# Altium schematic sheet 开关控制器SCH.SchDoc: 恒流恒压开关电源部分
size 381 x 203 mm; Author: Staok; DrawnBy: 许皓阳; Revision: 3.14
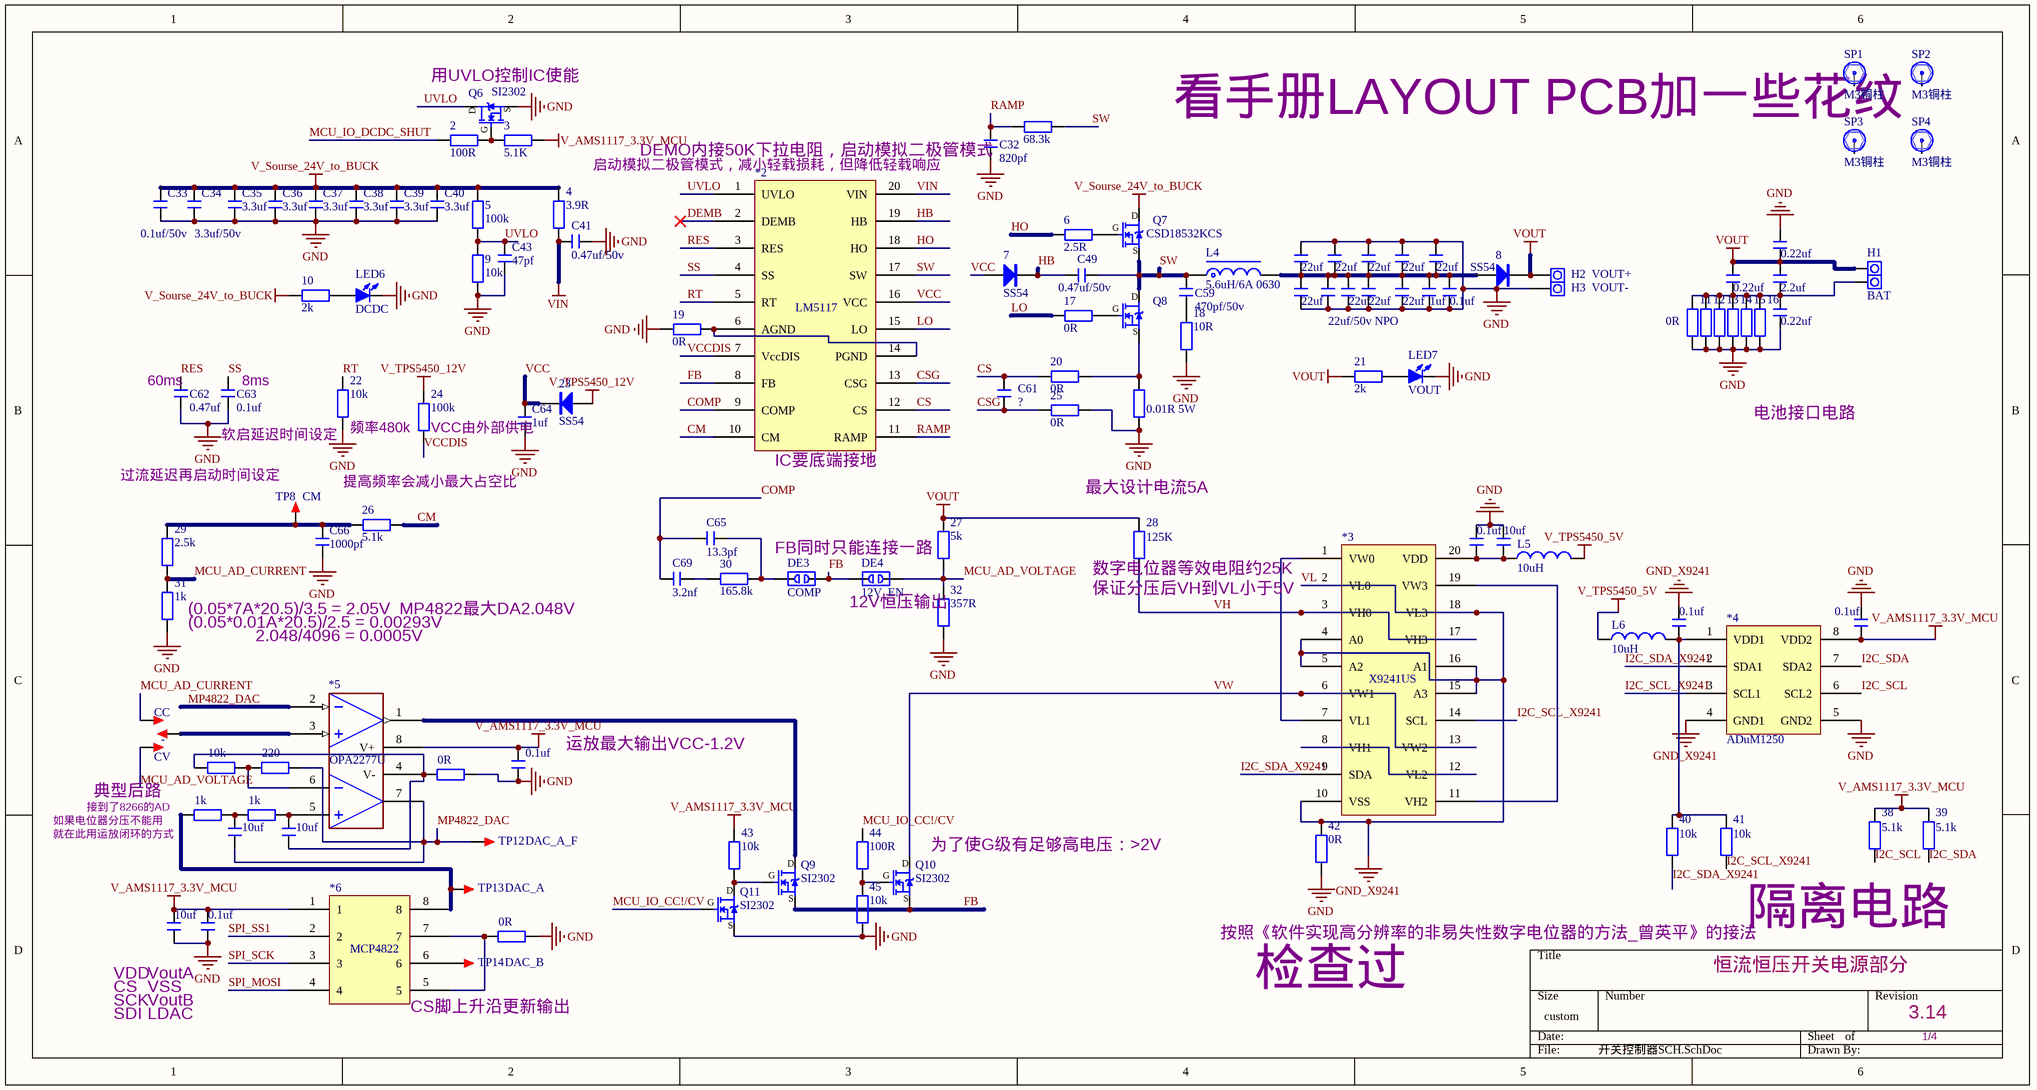
[diagram p0: 开关控制器SCH.SchDoc]

## Parts
1  68.3k  [R 0805_M]
2  100R  [R 0805_M]
3  5.1K  [R 0805_M]
4  3.9R  [R 0805_M]
5  100k  [R 0805_M]
6  2.5R  [R 0805_M]
7  SS54  [SMA]
8  SS54  [SMA]
9  10k  [R 0805_M]
10  2k  [R 0805_M]
11  0R  [R 0805_M]  (value not drawn)
12  0R  [R 0805_M]  (value not drawn)
13  0R  [R 0805_M]  (value not drawn)
14  0R  [R 0805_M]
15  0R  [R 0805_M]  (value not drawn)
16  0R  [R 0805_M]  (value not drawn)
17  0R  [R 0805_M]
18  10R  [R 0805_M]
19  0R  [R 0805_M]
20  0R  [R 0805_M]
21  2k  [R 0805_M]
22  10k  [R 0805_M]
23  SS54  [SMA]
24  100k  [R 0805_M]
25  0R  [R 0805_M]
26  5.1k  [R 0805_M]
27  5k  [R 0805_M]
28  125K  [R 0805_M]
29  2.5k  [R 0805_M]
30  165.8k  [R 0805_M]
31  1k  [R 0805_M]
32  357R  [R 0805_M]
33  10k  [R 0805_M]
34  220  [R 0805_M]
35  0R  [R 0805_M]
36  1k  [R 0805_M]
37  1k  [R 0805_M]
38  5.1k  [R 0805_M]
39  5.1k  [R 0805_M]
40  10k  [R 0805_M]
41  10k  [R 0805_M]
42  0R  [R 0805_M]
43  10k  [R 0805_M]
44  100R  [R 0805_M]
45  10k  [R 0805_M]
46  0R  [R 0805_M]
*2  LM5117  [SSOP20_M]
*3  X9241US  [SOP20_M]
*4  ADuM1250  [SOP8_N]
*5  OPA2277U  [SOP8_M]
*6  MCP4822  [SOP8_M]
C32  820pf  [C 0805_M]
C33  0.1uf/50v  [C 0805_M]
C34  3.3uf/50v  [C 0805_M]
C35  3.3uf  [C 0805_M]
C36  3.3uf  [C 0805_M]
C37  3.3uf  [C 0805_M]
C38  3.3uf  [C 0805_M]
C39  3.3uf  [C 0805_M]
C40  3.3uf  [C 0805_M]
C41  0.47uf/50v  [C 0805_M]
C42  0.22uf  [C 0805_M]
C43  47pf  [C 0805_M]
C44  22uf  [C 0805_M]
C45  22uf  [C 0805_M]
C46  22uf  [C 0805_M]
C47  22uf  [C 0805_M]
C48  22uf  [C 0805_M]
C49  0.47uf/50v  [C 0805_M]
C50  0.22uf  [C 0805_M]
C51  2.2uf  [C 0805_M]
C52  22uf  [C 0805_M]
C53  22uf/50v NPO  [C 0805_M]
C54  22uf  [C 0805_M]
C55  22uf  [C 0805_M]
C56  22uf  [C 0805_M]
C57  1uf  [C 0805_M]
C58  0.1uf  [C 0805_M]
C59  470pf/50v  [C 0805_M]
C60  0.22uf  [C 0805_M]
C61  ?  [C 0805_M]
C62  0.47uf  [C 0805_M]
C63  0.1uf  [C 0805_M]
C64  1uf  [C 0805_M]
C65  13.3pf  [C 0805_M]
C66  1000pf  [C 0805_M]
C67  0.1uf  [C 0805_M]
C68  10uf  [C 0805_M]
C69  3.2nf  [C 0805_M]
C70  0.1uf  [C 0805_M]
C71  0.1uf  [C 0805_M]
C72  0.1uf  [C 0805_M]
C73  10uf  [C 0805_M]
C74  10uf  [C 0805_M]
C75  10uf  [C 0805_M]
C76  0.1uf  [C 0805_M]
DE3  COMP  [DEBUG_B]
DE4  12V_EN  [DEBUG_B]
H1  BAT  [T_head]
H2  VOUT+  [PAD1-SMD-C]
H3  VOUT-  [PAD1-SMD-C]
L4  5.6uH/6A 0630  [L-SMD-0630]
L5  10uH  [L 0805_M]
L6  10uH  [L 0805_M]
LED6  DCDC  [LED 0805G]
LED7  VOUT  [LED 0805G]
Q6  SI2302  [SOT23-3N]
Q7  CSD18532KCS  [TO220A]
Q8  CSD18532KCS  [TO220A]  (value not drawn)
Q9  SI2302  [SOT23-3N]
Q10  SI2302  [SOT23-3N]
Q11  SI2302  [SOT23-3N]
R68  0.01R 5W  [RS 3W-V7]
SP1  M3铜柱  [M3x4+6_N]
SP2  M3铜柱  [M3x4+6_N]
SP3  M3铜柱  [M3x4+6_N]
SP4  M3铜柱  [M3x4+6_N]
TP8  CM  [TEST 1]
TP9  CC  [TEST 1]
TP10  -  [TEST 1]
TP11  CV  [TEST 1]
TP12  DAC_A_F  [TEST 1]
TP13  DAC_A  [TEST 1]
TP14  DAC_B  [TEST 1]

## Nets
GND: 9.1 11.2 12.2 13.2 14.2 15.2 16.2 18.2 19.2 22.2 25.1 31.1 32.2 35.1 42.1 45.1 46.1 *4.5(GND2) C32.2 C33.1 C34.1 C35.1 C36.1 C37.1 C38.1 C39.1 C40.1 C41.1 C42.1 C43.1 C44.1 C45.1 C46.1 C47.1 C48.1 C52.2 C53.2 C54.2 C55.2 C56.2 C57.2 C58.2 C60.2 C62.2 C63.2 C64.1 C66.1 C67.2 C68.2 C71.2 C72.1 C75.1 C76.1 H3.1 LED6.2(K) LED7.2(K) Q6.2(S) Q11.2(S) R68.1
V_AMS1117_3.3V_MCU: 3.1 38.1 39.1 43.2 *4.8(VDD2) *5.8(V+) *6.1 C71.1 C72.2 C75.2 C76.2
V_Sourse_24V_to_BUCK: 4.1 5.2 10.2 C33.2 C34.2 C35.2 C36.2 C37.2 C38.2 C39.2 C40.2 Q7.2(D)
V_TPS5450_5V: L5.2 L6.1
V_TPS5450_12V: 23.1(A) 24.1
VIN: 4.2 *2.20(VIN) C41.2
VL: 42.2 *3.2(VL0) *3.4(A0) *3.5(A2) *3.10(VSS) *3.15(A3) *3.16(A1) *3.18(VL3) *4.4(GND1) C70.2  [also labelled GND_X9241]
VOUT: 8.2(K) 21.2 27.1 28.1 C42.2 C50.1 C51.1 H1.1 H2.1
CM: 26.2 *2.10(CM)
COMP: *2.9(COMP) C65.1 C69.1
CS: 20.2 *2.12(CS) C61.1
CSG: 25.2 *2.13(CSG) C61.2
DEMB: *2.2(DEMB)
FB: *2.8(FB) DE3.2 DE4.1 Q9.2(S) Q10.2(S)
HB: 7.2(K) *2.19(HB) C49.2
HO: 6.2 *2.18(HO)
I2C_SCL: 38.2 *4.6(SCL2)
I2C_SCL_X9241: 41.2 *3.14(SCL) *4.3(SCL1)
I2C_SDA: 39.2 *4.7(SDA2)
I2C_SDA_X9241: 40.2 *3.9(SDA) *4.2(SDA1)
LO: 17.2 *2.15(LO)
MCU_AD_CURRENT: 29.1 31.2 TP9.1
MCU_AD_VOLTAGE: 27.2 32.1 DE4.2 TP11.1
MCU_IO_CC!/CV: 44.1 Q11.1(G)
MCU_IO_DCDC_SHUT: 2.2
MP4822_DAC: 34.1 *5.2(In_A-) *5.7(Out_B) C73.1 TP12.1
RAMP: 1.2 *2.11(RAMP) C32.1
RES: *2.3(RES) C62.1
RT: 22.1 *2.5(RT)
SPI_MOSI: *6.4
SPI_SCK: *6.3
SPI_SS1: *6.2
SS: *2.4(SS) C63.1
SW: 1.1 *2.17(SW) C49.1 C59.1 L4.1 Q7.3(S) Q8.2(D)
UVLO: 5.1 9.2 *2.1(UVLO) C43.2 Q6.3(D)
VCC: 7.1(A) 23.2(K) *2.16(VCC) C64.2
VCCDIS: 24.2 *2.7(VccDIS)
VH: 28.2 *3.3(VH0) *3.17(VH3)
VW: *3.6(VW1) *3.13(VW2) Q10.3(D)
Net2_1: 2.1 3.2 Q6.1(G)
Net6_1: 6.1 Q7.1(G)
Net8_1: 8.1(A) C44.2 C45.2 C46.2 C47.2 C48.2 C52.1 C53.1 C54.1 C55.1 C56.1 C57.1 C58.1 L4.2
Net10_1: 10.1 LED6.1(A)
Net11_1: 11.1 12.1 13.1 14.1 15.1 16.1 C50.2 C51.2 C60.1 H1.2
Net17_1: 17.1 Q8.1(G)
Net18_1: 18.1 C59.2
Net19_1: 19.1 *2.6(AGND) *2.14(PGND)
Net20_1: 20.1 Q8.3(S) R68.2
Net21_1: 21.1 LED7.1(A)
Net26_1: 26.1 29.2 C66.2 TP8.1
Net30_1: 30.1 C69.2
Net30_2: 30.2 C65.2 DE3.1
Net33_1: 33.1 34.2 *5.6(In_B-)
Net33_2: 33.2 35.2 *5.4(V-) C74.1
Net36_1: 36.1 37.2 C73.2
Net36_2: 36.2 *6.8 TP13.1
Net37_1: 37.1 *5.5(In_B+) C74.2
Net40_1: 40.1 41.1 *4.1(VDD1) C70.1 L6.2
Net43_1: 43.1 Q9.1(G) Q11.3(D)
Net44_2: 44.2 45.2 Q10.1(G)
Net46_2: 46.2 *6.5 *6.7
Net*3_1: *3.1(VW0) *3.7(VL1)
Net*3_8: *3.8(VH1) *3.12(VL2)
Net*3_11: *3.11(VH2) *3.19(VW3)
Net*3_20: *3.20(VDD) C67.1 C68.1 L5.1
Net*5_1: *5.1(Out_A) Q9.3(D)
Net*5_3: *5.3(In_A+) TP10.1
Net*6_6: *6.6 TP14.1

Not connected (* = marked no-connect by the designer): SP1 1; SP2 1; SP3 1; SP4 1

## Notes on the sheet
- (near Q6) 用UVLO控制IC使能
- (near *2) 启动模拟二极管模式，减小轻载损耗，但降低轻载响应
- (near *2) DEMO内接50K下拉电阻，启动模拟二极管模式
- 看手册LAYOUT PCB加一些花纹
- (near C62) 60ms
- (near C63) 软启延迟时间设定
- (near C63) 8ms
- (near 22) 频率480k
- (near 24) VCC由外部供电
- 电池接口电路
- 过流延迟再启动时间设定
- 提高频率会减小最大占空比
- (near *2) IC要底端接地
- (near 28) 最大设计电流5A
- FB同时只能连接一路
- (near 28) 数字电位器等效电阻约25K
- (near 31) (0.05*7A*20.5)/3.5 = 2.05V  MP4822最大DA2.048V
- (near 31) (0.05*0.01A*20.5)/2.5 = 0.00293V
- (near DE4) 12V恒压输出
- (near 28) 保证分压后VH到VL小于5V
- 2.048/4096 = 0.0005V
- (near C72) 运放最大输出VCC-1.2V
- 如果电位器分压不能用
- 就在此用运放闭环的方式
- 接到了8266的AD
- 典型后路
- (near Q10) 为了使G级有足够高电压：>2V
- VDD
- VoutA
- 按照《软件实现高分辨率的非易失性数字电位器的方法_曾英平》的接法
- 隔离电路
- CS
- SCK
- SDI
- VSS
- VoutB
- LDAC
- (near *6) CS脚上升沿更新输出
- 检查过
- 1/4

## Library data of the parts
1-6 9-22 24-46 = R: 贴片电阻; 版权归属: 源创客; BOM名称: 贴片电阻; 学习资源: www.ooocke.com
7 8 23 = SS34: 肖特基二极管; 版权归属: 源创客; 属性: 40V/3A; BOM名称: 肖特基二极管; 学习资源: www.ooocke.com
*5 = OPA2277
*6 = 8
C32-C76 = C: 无极性贴片电容; 版权归属: 源创客; BOM名称: 无极性贴片电容; 学习资源: www.ooocke.com
DE3 DE4 = DEBUG: 调试断点焊盘; 版权归属: 源创客; BOM名称: 调试断点焊盘; 学习资源: www.ooocke.com
H1 = PAD2: 引线焊盘; 版权归属: 源创客; BOM名称: 引线焊盘; 学习资源: www.ooocke.com
H2 H3 = PAD1: 引线焊盘; 版权归属: 源创客; BOM名称: 引线焊盘; 学习资源: www.ooocke.com
L4 = L-CDRH: 功率屏蔽电感; 版权归属: 源创客; BOM名称: 功率屏蔽电感; 学习资源: www.ooocke.com
L5 L6 = L: 小功率贴片电感; 版权归属: 源创客; BOM名称: 小功率贴片电感; 学习资源: www.ooocke.com
LED6 LED7 = LED-SMD: 贴片LED; 版权归属: 源创客; BOM名称: 贴片LED; 学习资源: www.ooocke.com
Q6 Q9-Q11 = SI2302: N沟道 20V/3A; BOM名称: 场效应管; 版权归属: 源创客; 学习资源: www.ooocke.com; 描述: N沟道 20V/3A
Q7 Q8 = 2SK3615: BOM名称: 场效应管; 版权归属: 源创客; 学习资源: www.ooocke.com
R68 = R-CRR: 直插色环电阻; BOM名称: 色环电阻; 版权归属: 源创客; 学习资源: www.ooocke.com
SP1-SP4 = 铜柱加头大焊盘: 铜柱; 版权归属: 源创客; BOM名称: 铜柱; 学习资源: www.ooocke.com
TP8-TP14 = TEST: 测试点; 版权归属: 源创客; BOM名称: 测试点; 学习资源: www.ooocke.com